# Altium schematic sheet f1_bd_3.SchDoc
size 383 x 203 mm; SheetNumber: 1; SheetTotal: 1
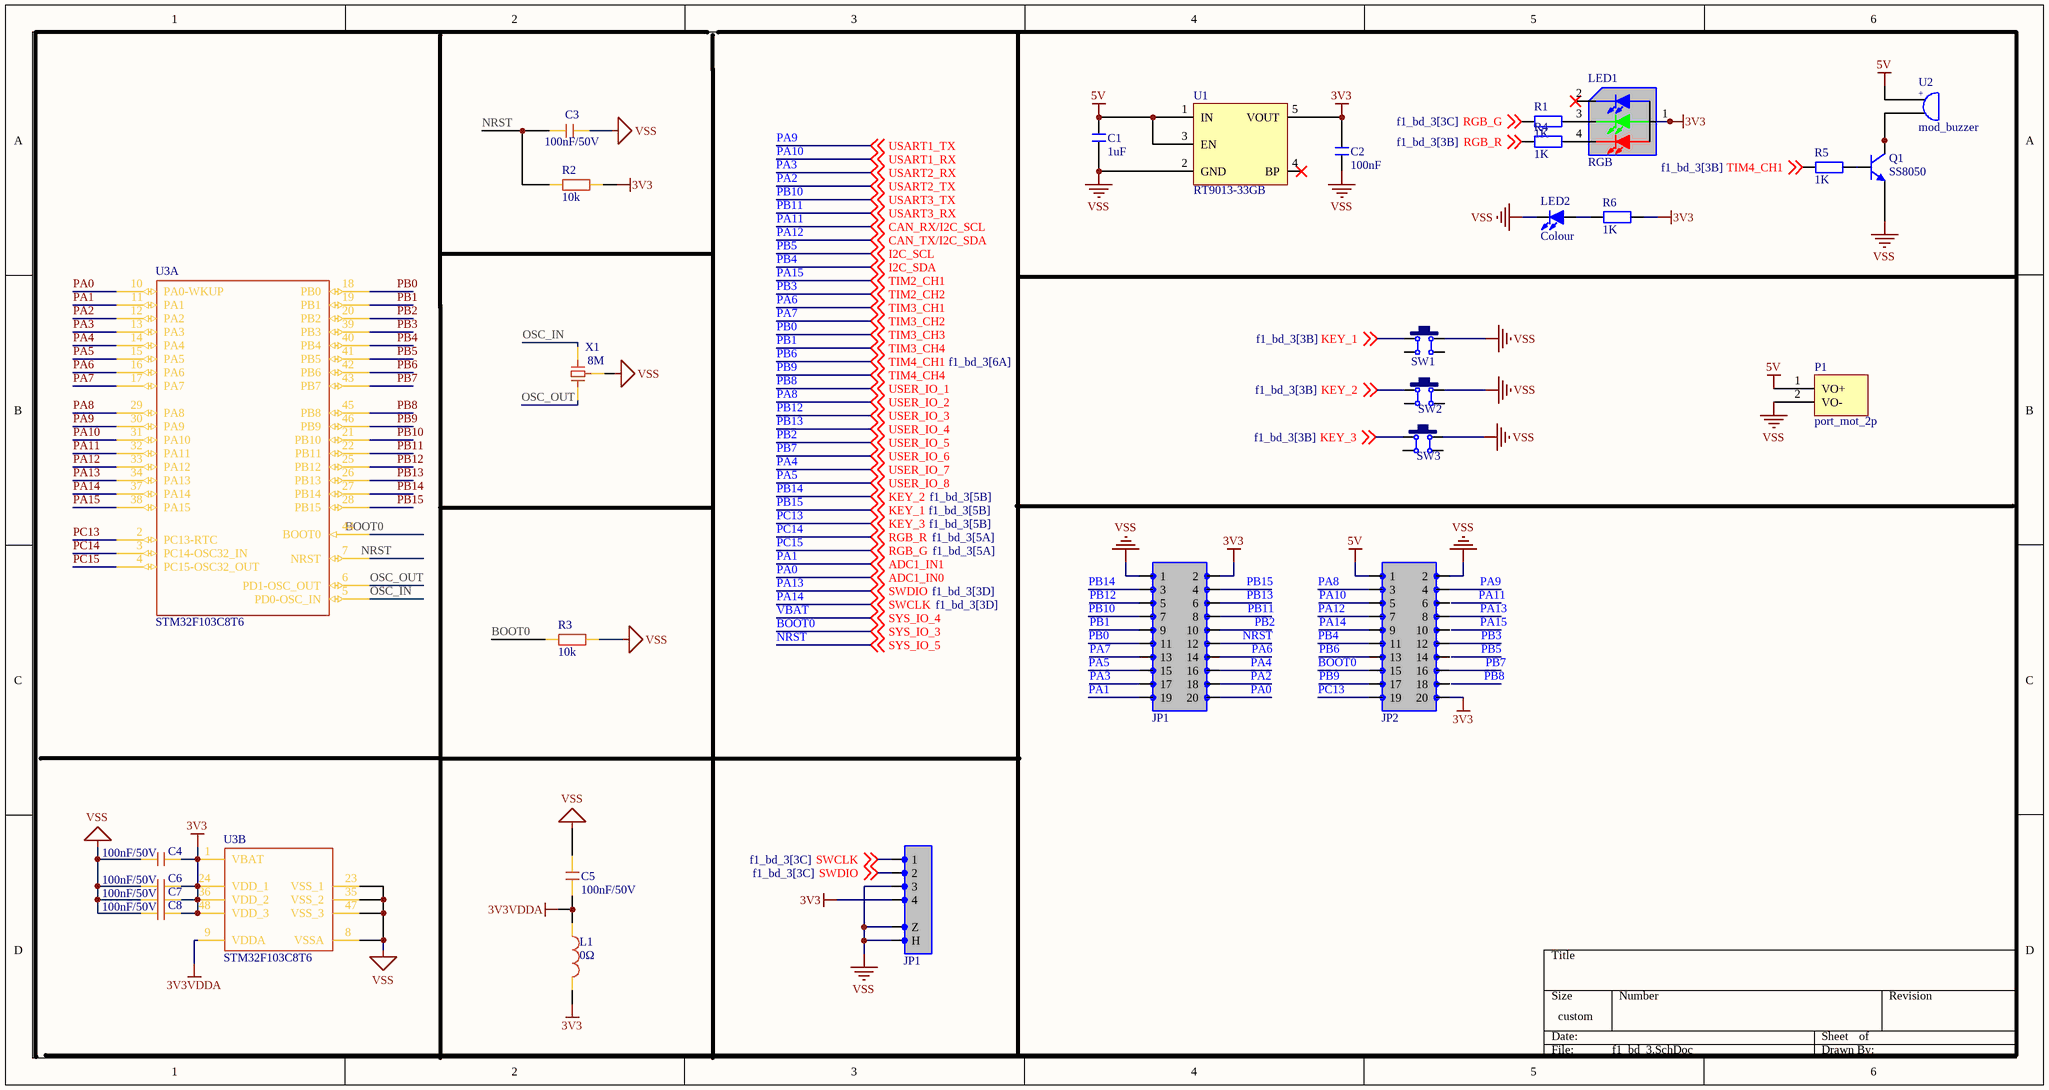
[diagram p0: f1_bd_3.SchDoc]

## Parts
(Parts that share a designator on the sheet are numbered #1, #2 ... from top to bottom, then left to right.)
C1  1uF  [C 0603_L]
C2  100nF  [C 0603_L]
C3  100nF/50V  [C 0603_L]
C4  100nF/50V  [C 0603_L]
C5  100nF/50V  [C 0603_L]
C6  100nF/50V  [C 0603_L]
C7  100nF/50V  [C 0603_L]
C8  100nF/50V  [C 0603_L]
JP1#1  Header 2X10  [HDR2.54-LI-2x10P]  (value not drawn)
JP1#2  HDR-1X4  [GH 1.25-LS-4P]  (value not drawn)
JP2  Header 2X10  [HDR2.54-LI-2x10P]  (value not drawn)
L1  0Ω  [L 0603]
LED1  RGB  [LED 3528-RGB]
LED2  Colour  [LED 0603R]
P1  port_mot_2p  [XH2.54_2P]
Q1  SS8050  [SOT23-3L]
R1  1K  [R 0603_L]
R2  10k  [R 0603_L]
R3  10k  [R 0603_L]
R4  1K  [R 0603_L]
R5  1K  [R 0603_L]
R6  1K  [R 0603_L]
SW1  3.2x4.2x2.5  [TSW SMD-3*4*2]  (value not drawn)
SW2  3.2x4.2x2.5  [TSW SMD-3*4*2]  (value not drawn)
SW3  3.2x4.2x2.5  [TSW SMD-3*4*2]  (value not drawn)
U1  RT9013-33GB  [SOT23-5]
U2  mod_buzzer  [MOD_BUZZER]
U3  STM32F103C8T6  [LQFP48 7X7_L]  (parts A,B of 2)
X1  8M  [OSC 3213-3P]

## Nets
3V3: C2.1 C4.2 C6.2 C7.2 C8.2 JP1#1.2 JP1#2.4 JP2.20 L1.2 LED1.1 R2.2 R6.2 U1.5(VOUT) U3.1(VBAT) U3.24(VDD_1) U3.36(VDD_2) U3.48(VDD_3)
3V3VDDA: C5.2 L1.1 U3.9(VDDA)
5V: C1.1 JP2.1 P1.1(VO+) U1.1(IN) U1.3(EN) U2.1
VSS: C1.2 C2.2 C3.2 C4.1 C5.1 C6.1 C7.1 C8.1 JP1#1.1 JP1#2.0(Z) JP1#2.3 JP1#2.100(H) JP2.2 LED2.2(K) P1.2(VO-) Q1.2(E) R3.2 SW1.1 SW2.1 SW3.1 U1.2(GND) U3.8(VSSA) U3.23(VSS_1) U3.35(VSS_2) U3.47(VSS_3) X1.3
BOOT0: JP2.15 R3.1 U3.44(BOOT0) ; off-sheet SYS_IO_3  [also labelled SYS_IO_3]
NRST: C3.1 JP1#1.12 R2.1 U3.7(NRST) ; off-sheet SYS_IO_5  [also labelled SYS_IO_5]
OSC_IN: U3.5(PD0-OSC_IN) X1.2
OSC_OUT: U3.6(PD1-OSC_OUT) X1.1
PA0: JP1#1.20 U3.10(PA0-WKUP) ; off-sheet ADC1_IN0  [also labelled ADC1_IN0]
PA1: JP1#1.19 U3.11(PA1) ; off-sheet ADC1_IN1  [also labelled ADC1_IN1]
PA2: JP1#1.18 U3.12(PA2) ; off-sheet USART2_TX  [also labelled USART2_TX]
PA3: JP1#1.17 U3.13(PA3) ; off-sheet USART2_RX  [also labelled USART2_RX]
PA4: JP1#1.16 U3.14(PA4) ; off-sheet USER_IO_7  [also labelled USER_IO_7]
PA5: JP1#1.15 U3.15(PA5) ; off-sheet USER_IO_8  [also labelled USER_IO_8]
PA6: JP1#1.14 U3.16(PA6) ; off-sheet TIM3_CH1  [also labelled TIM3_CH1]
PA7: JP1#1.13 U3.17(PA7) ; off-sheet TIM3_CH2  [also labelled TIM3_CH2]
PA8: JP2.3 U3.29(PA8) ; off-sheet USER_IO_2  [also labelled USER_IO_2]
PA9: JP2.4 U3.30(PA9) ; off-sheet USART1_TX  [also labelled USART1_TX]
PA10: JP2.5 U3.31(PA10) ; off-sheet USART1_RX  [also labelled USART1_RX]
PA11: U3.32(PA11) ; off-sheet CAN_RX/I2C_SCL  [also labelled CAN_RX/I2C_SCL]
PA12: JP2.7 U3.33(PA12) ; off-sheet CAN_TX/I2C_SDA  [also labelled CAN_TX/I2C_SDA]
PA13: JP1#2.2 JP2.8 U3.34(PA13) ; off-sheet SWDIO  [also labelled SWDIO]
PA14: JP1#2.1 JP2.9 U3.37(PA14) ; off-sheet SWCLK  [also labelled SWCLK]
PA15: U3.38(PA15) ; off-sheet TIM2_CH1  [also labelled TIM2_CH1]
PB0: JP1#1.11 U3.18(PB0) ; off-sheet TIM3_CH3  [also labelled TIM3_CH3]
PB1: JP1#1.9 U3.19(PB1) ; off-sheet TIM3_CH4  [also labelled TIM3_CH4]
PB2: JP1#1.10 U3.20(PB2) ; off-sheet USER_IO_5  [also labelled USER_IO_5]
PB3: JP2.12 U3.39(PB3) ; off-sheet TIM2_CH2  [also labelled TIM2_CH2]
PB4: JP2.11 U3.40(PB4) ; off-sheet I2C_SDA  [also labelled I2C_SDA]
PB5: U3.41(PB5) ; off-sheet I2C_SCL  [also labelled I2C_SCL]
PB6: JP2.13 R5.1 U3.42(PB6) ; off-sheet TIM4_CH1  [also labelled TIM4_CH1]
PB7: JP2.16 U3.43(PB7) ; off-sheet USER_IO_6  [also labelled USER_IO_6]
PB8: U3.45(PB8) ; off-sheet USER_IO_1  [also labelled USER_IO_1]
PB9: JP2.17 U3.46(PB9) ; off-sheet TIM4_CH4  [also labelled TIM4_CH4]
PB10: JP1#1.7 U3.21(PB10) ; off-sheet USART3_TX  [also labelled USART3_TX]
PB11: JP1#1.8 U3.22(PB11) ; off-sheet USART3_RX  [also labelled USART3_RX]
PB12: JP1#1.5 U3.25(PB12) ; off-sheet USER_IO_3  [also labelled USER_IO_3]
PB13: JP1#1.6 U3.26(PB13) ; off-sheet USER_IO_4  [also labelled USER_IO_4]
PB14: JP1#1.3 SW2.2 U3.27(PB14) ; off-sheet KEY_2  [also labelled KEY_2]
PB15: JP1#1.4 SW1.2 U3.28(PB15) ; off-sheet KEY_1  [also labelled KEY_1]
PC13: JP2.19 SW3.2 U3.2(PC13-RTC) ; off-sheet KEY_3  [also labelled KEY_3]
PC14: R4.1 U3.3(PC14-OSC32_IN) ; off-sheet RGB_R  [also labelled RGB_R]
PC15: R1.1 U3.4(PC15-OSC32_OUT) ; off-sheet RGB_G  [also labelled RGB_G]
NetLED1_3: LED1.3 R1.2
NetLED1_4: LED1.4 R4.2
NetLED2_1: LED2.1(A) R6.1
NetQ1_1: Q1.1(B) R5.2
NetQ1_3: Q1.3(C) U2.2

Not connected (* = marked no-connect by the designer): JP2 6 10 14 18; LED1 2*; SW1 3 4; SW2 3 4; SW3 3 4; U1 4(BP)*

## Notes on the sheet
- (in symbol mod_buzzer) +

## Library data of the parts
C1 C2 = C: 无极性贴片电容; 版权归属: 源创客; BOM名称: 无极性贴片电容; 学习资源: www.ooocke.com
C3-C8 = 无极贴片电容: 贴片电容
JP1#1 JP2 = Header 10X2: 10*2P接插件; 版权归属: 源创客; BOM名称: 10*2P接插件; 学习资源: www.ooocke.com
JP1#2 = Header 4: 4P接插件; 版权归属: 源创客; BOM名称: 4P接插件; 学习资源: www.ooocke.com
L1 = 磁珠: 小功率贴片电感
LED1 = LED-RGB-A: 共阳三基色LED; BOM名称: 三基色LED; 版权归属: 源创客; 学习资源: www.ooocke.com
LED2 = LED-SMD: 贴片LED; 版权归属: 源创客; BOM名称: 贴片LED; 学习资源: www.ooocke.com
P1 = port_mot_2p: 开环直流电机接口 / XH2.54弯排针2p
Q1 = 8050-SMD: 高频放大-NPN型; 版权归属: 源创客; 属性: 40V 1.5A 1W 100MHZ; BOM名称: 高频放大-NPN型; 学习资源: www.ooocke.com
R1 R4-R6 = R: 贴片电阻; 版权归属: 源创客; BOM名称: 贴片电阻; 学习资源: www.ooocke.com
R2 R3 = 电阻: 贴片电阻1%精度
SW1-SW3 = TSW SMD-3x4_D: 3.2x4.2轻触开关; BOM名称: 3x6轻触开关; 版权归属: 源创客; 学习资源: www.ooocke.com
U1 = RT9193-33GB
U2 = mod_buzzer: 有源蜂鸣器
U3 = STM32F103C8T6: STM32F103C8T6是一款由意法半导体公司（ST）推出的基于Cortex-M3内核的32位微控制器，硬件采用LQFP48封装，属于ST公司微控制器中的STM32系列。
X1 = XTAL-3P: 3脚内置电容无源晶振